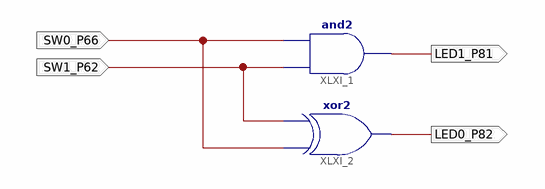
[diagram p0: schematic sheet 1]
// Xilinx ISE schematic HalfAdder.sch (spartan6) as structural Verilog: 2 symbols, 4 ports
module HalfAdder (
  input  SW1_P62,
  input  SW0_P66,
  output LED1_P81,
  output LED0_P82
);

  and XLXI_1 (LED1_P81, SW1_P62, SW0_P66);
  xor XLXI_2 (LED0_P82, SW0_P66, SW1_P62);
endmodule
